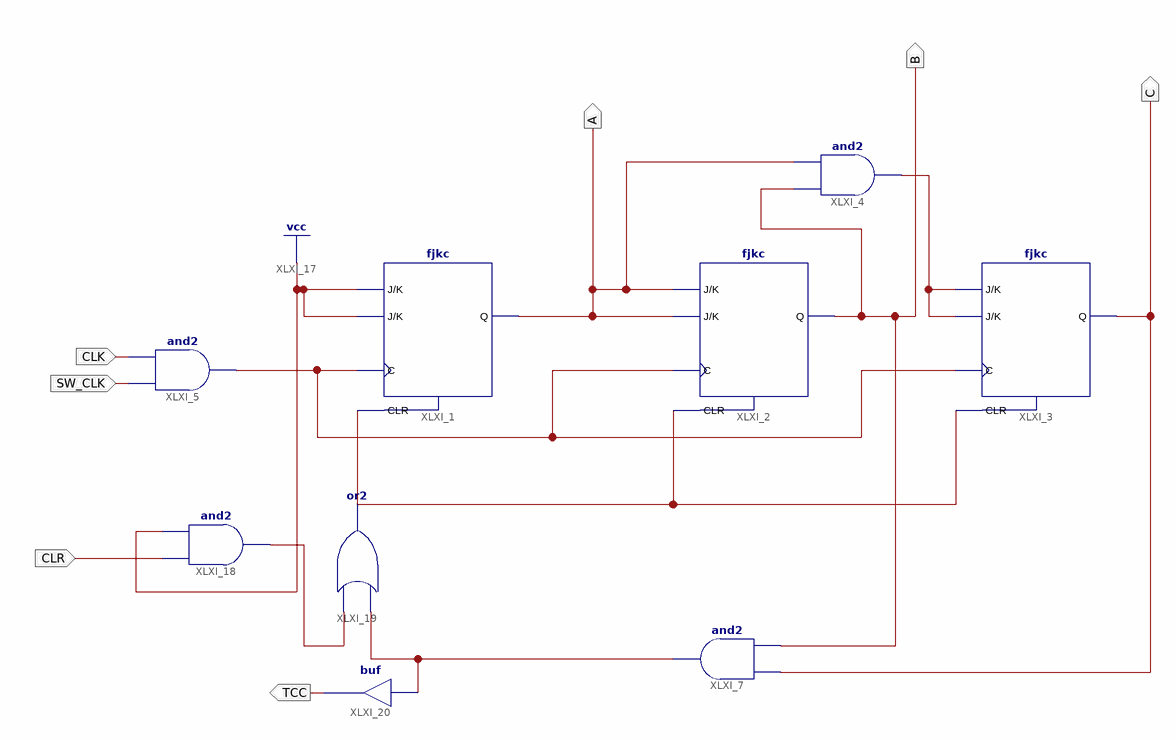
[diagram p0: schematic sheet 1]
// Xilinx ISE schematic COU1_6.sch (spartan6) as structural Verilog: 9 symbols, 7 ports
module COU1_6 (
  input  SW_CLK,
  input  CLK,
  input  CLR,
  output A,
  output B,
  output C,
  output TCC
);

  wire XLXN_8, XLXN_31, XLXN_32, XLXN_33, XLXN_34;

  fjkc XLXI_1 (.C(XLXN_31), .CLR(XLXN_32), .J(1'b1), .K(1'b1), .Q(A));
  fjkc XLXI_2 (.C(XLXN_31), .CLR(XLXN_32), .J(A), .K(A), .Q(B));
  fjkc XLXI_3 (.C(XLXN_31), .CLR(XLXN_32), .J(XLXN_8), .K(XLXN_8), .Q(C));
  and XLXI_4 (XLXN_8, B, A);
  and XLXI_5 (XLXN_31, SW_CLK, CLK);
  and XLXI_18 (XLXN_33, CLR, 1'b1);
  and XLXI_7 (XLXN_34, B, C);
  or XLXI_19 (XLXN_32, XLXN_34, XLXN_33);
  buf XLXI_20 (TCC, XLXN_34);
endmodule
